# EAGLE schematic untitled (EAGLE 6.4)
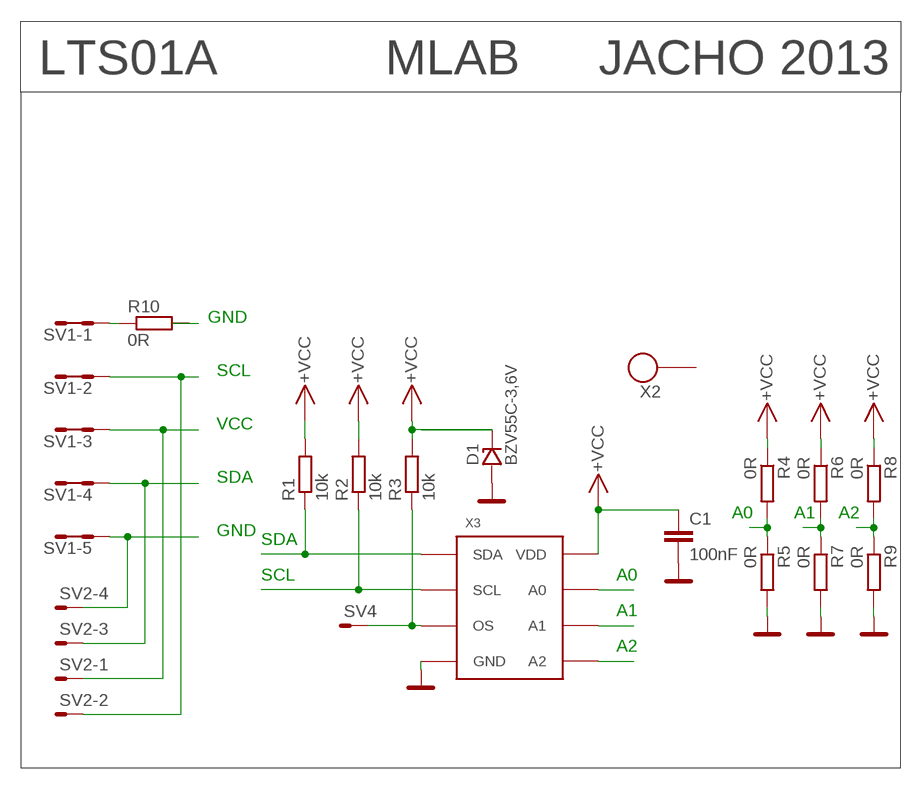
[diagram p0: schematic, sheet 1]

## Parts
C1  100nF  C-EUC0603  [C0603]
D1  BZV55C-3,6V  D-ZENEROVA  [MINIMELF]
R1  10k  R-EU_R0603  [R0603]
R2  10k  R-EU_R0603  [R0603]
R3  10k  R-EU_R0603  [R0603]
R4  0R  R-EU_R0603  [R0603]
R5  0R  R-EU_R0603  [R0603]
R6  0R  R-EU_R0603  [R0603]
R7  0R  R-EU_R0603  [R0603]
R8  0R  R-EU_R0603  [R0603]
R9  0R  R-EU_R0603  [R0603]
R10  0R  R-EU_R0603  [R0603]
SV1  MA05-2  [MA05-2]
SV2  SMD_MA04-01  [SMD_MA04-1]
SV4  MA01-1  [MA01-1]
X2  SROUB3M  [SROUB3M]
X3  MAX31725  [TDFN8]

## Nets
A0: R4.2 R5.1 X3.7(A0)
A1: R6.2 R7.1 X3.6(A1)
A2: R8.2 R9.1 X3.5(A2)
GND: C1.2 D1.A R5.2 R7.2 R9.2 R10.2 SV1.9 SV1.10 SV2.4 X3.4(GND) X3.9(GND)
N$1: R10.1 SV1.1 SV1.2
OS: R3.1 SV4.1 X3.3(OS)
SCL: R2.1 SV1.3 SV1.4 SV2.2 X3.2(SCL)
SDA: R1.1 SV1.7 SV1.8 SV2.3 X3.1(SDA)
VCC: C1.1 D1.C(K) R1.2 R2.2 R3.2 R4.1 R6.1 R8.1 SV1.5 SV1.6 SV2.1 X3.8(VDD) ; supply symbol labelled +VCC
Unconnected: X2.P$1

## Notes on the sheet
- LTS01A | MLAB | JACHO 2013
- GND
- SCL
- VCC
- SDA
- A0 | A1 | A2
- GND
- SDA
- SCL | A0
- A1
- A2

## Library data of the parts
C1 = rcl:C-EU: CAPACITOR, European symbol
D1 = moje_diody:D-ZENEROVA
R1-R10 = rcl:R-EU_: RESISTOR, European symbol
SV1 = moje_hrebinky:MA05-2: PIN HEADER; OC_FARNELL: unknown; OC_NEWARK: unknown
SV2 = moje_hrebinky:SMD_MA04-01
SV4 = moje_hrebinky:MA01-1
X2 = moje:SROUB3M
X3 = moje_io:MAX31725: MAX31725 senzor teploty. Pouzdro TDFN 8pin.